# Altium schematic sheet Output.SchDoc
size A4
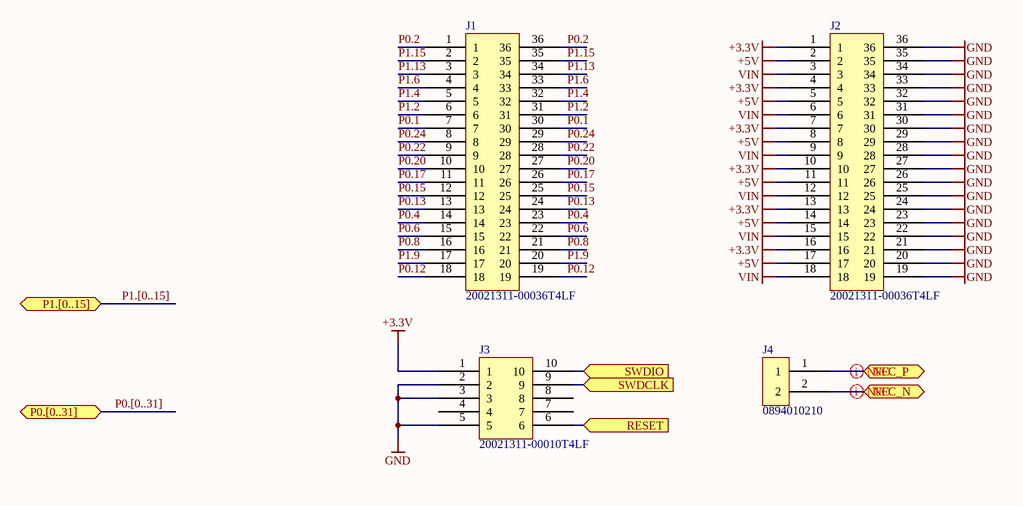
[diagram p0: Output.SchDoc]

## Parts
J1  20021311-00036T4LF  [DIP36]
J2  20021311-00036T4LF  [DIP36]
J3  20021311-00010T4LF  [DIP10]
J4  0894010210  [DIP2]

## Ports
NFC_N, NFC_P, P0.[0..31] (bidir), P1.[0..15], RESET (in), SWDCLK (in), SWDIO (in)

## Nets
+3.3V: J2.1 J2.4 J2.7 J2.10 J2.13 J2.16 J3.1
+5V: J2.2 J2.5 J2.8 J2.11 J2.14 J2.17
GND: J2.19 J2.20 J2.21 J2.22 J2.23 J2.24 J2.25 J2.26 J2.27 J2.28 J2.29 J2.30 J2.31 J2.32 J2.33 J2.34 J2.35 J2.36 J3.2 J3.3 J3.5
VIN: J2.3 J2.6 J2.9 J2.12 J2.15 J2.18
NFC_N: J4.2 ; port NFC_N
NFC_P: J4.1 ; port NFC_P
P0.1: J1.7 J1.30
P0.2: J1.1 J1.36
P0.4: J1.14 J1.23
P0.6: J1.15 J1.22
P0.8: J1.16 J1.21
P0.12: J1.18 J1.19
P0.13: J1.13 J1.24
P0.15: J1.12 J1.25
P0.17: J1.11 J1.26
P0.20: J1.10 J1.27
P0.22: J1.9 J1.28
P0.24: J1.8 J1.29
P1.2: J1.6 J1.31
P1.4: J1.5 J1.32
P1.6: J1.4 J1.33
P1.9: J1.17 J1.20
P1.13: J1.3 J1.34
P1.15: J1.2 J1.35
RESET: J3.6 ; port RESET
SWDCLK: J3.9 ; port SWDCLK
SWDIO: J3.10 ; port SWDIO

Not connected (* = marked no-connect by the designer): J3 4 7 8

## Buses and harness runs
bus P0.[0..31] = port P0.[0..31]
bus P1.[0..15] = port P1.[0..15]

## Layout directives
differential pair; net class NFC: NFC_N, NFC_P

## Library data of the parts
J1 J2 = 20021311-00036T4LF: 36 Position Receptacle Connector 0.050" (1.27mm) Through Hole Gold; Manufacturer: Amphenol FCI; Current Rating: 1A; Voltage Rating: 125V; Contact Resistance: 30mR; Number of Positions: 36; Connector Type: Receptacle,Socket; Gender: Female; Row Spacing: 0.05inch; CHECKED: false; Supplier 1: Digi-Key; Manufacturer Part Number: 20021311-00036T4LF; Stock 1: 859; Pricing 1: 1=2.66, 25=2.3368, 100=2.1242, 500=1.8056, 1000=1.5401, 5000=1.3807 (USD); Mount: Through Hole; Contact Plating: Gold; Contact Material: Copper Alloy; Colour: Black; Housing Material: Plastic; Min Operating Temperature: -40°C; Max Operating Temperature: 85°C; Packaging: Rail/Tube; Number of Rows: 2; Package Quantity: 25; Termination: Solder; Number of Contacts: 36; Max Voltage Rating (AC): 125V; Orientation: Straight; Length: 21.59mm; Pitch: 1.27mm; Depth: 3mm; Supplier Part Number 1: 609-3765-ND
J3 = 20021311-00010T4LF: 10 Position Receptacle Connector 0.050" (1.27mm) Through Hole Gold; Manufacturer: Amphenol FCI; Contact Resistance: 30mR; Current Rating: 1A; Voltage Rating: 125V; Number of Positions: 10; Connector Type: Receptacle,Socket; Insulation Resistance: 1GR; Row Spacing: 0.05inch; Checked: False; Supplier 1: Digi-Key; Manufacturer Part Number: 20021311-00010T4LF; Stock 1: 21801; Pricing 1: 1=1.03, 86=0.8154, 172=0.7799, 516=0.6381, 1032=0.5672, 5074=0.4963, 10062=0.4715 (USD); Mount: Through Hole; Contact Plating: Gold; Contact Material: Copper,Copper Alloy,Gold; Colour: Black; Housing Material: Thermoplastic; Min Operating Temperature: -55°C; Max Operating Temperature: 125°C; Number of Rows: 2; Packaging: Rail/Tube; Package Quantity: 86; Termination: Solder; Max Voltage Rating (AC): 125V; Number of Contacts: 10; Gender: Receptacle; Orientation: Straight; Contact Gender: Male; Length: 5.08mm; Pitch: 1.27mm; Depth: 3mm; Termination Post Length: 2.4mm; REACH SVHC: No SVHC; Lead Free: Lead Free; Flammability Rating: UL94 V-0; Supplier Part Number 1: 609-3754-ND
J4 = 0894010210: Conn Shrouded Header HDR 2 POS 2mm Solder RA Thru-Hole Bag; Manufacturer: Molex; Number of Positions: 2; Connector Type: Male Pin; Checked: False; Supplier 1: Digi-Key; Manufacturer Part Number: 0894010210; Stock 1: 9337; Pricing 1: 1=0.13, 10=0.123, 100=0.0757, 500=0.0626, 1000=0.0548, 5000=0.047, 10000=0.0457 (USD); Mount: Through Hole; Contact Material: Brass; Contact Plating: Copper,Tin; Colour: Natural; Housing Material: Nylon; Housing Colour: Natural; Min Operating Temperature: -25°C; Max Operating Temperature: 85°C; Number of Rows: 1; Package Quantity: 9000; Packaging: Bulk; Termination: Solder; Number of Contacts: 2; Orientation: Right Angle; Length: 6mm; Pitch: 2mm; Depth: 7.6mm; Radiation Hardening: No; Supplier Part Number 1: WM14854-ND